# Altium schematic sheet Core.SchDoc: DrumLooper
size A3; Author: Max; CompanyName: maxvandenbussche.be; DrawnBy: Max; Engineer: Max; Organization: project; Address1: Synthasaurus; Address2: Percussion; Address4: Max Vandenbussche; DocumentNumber: 180606
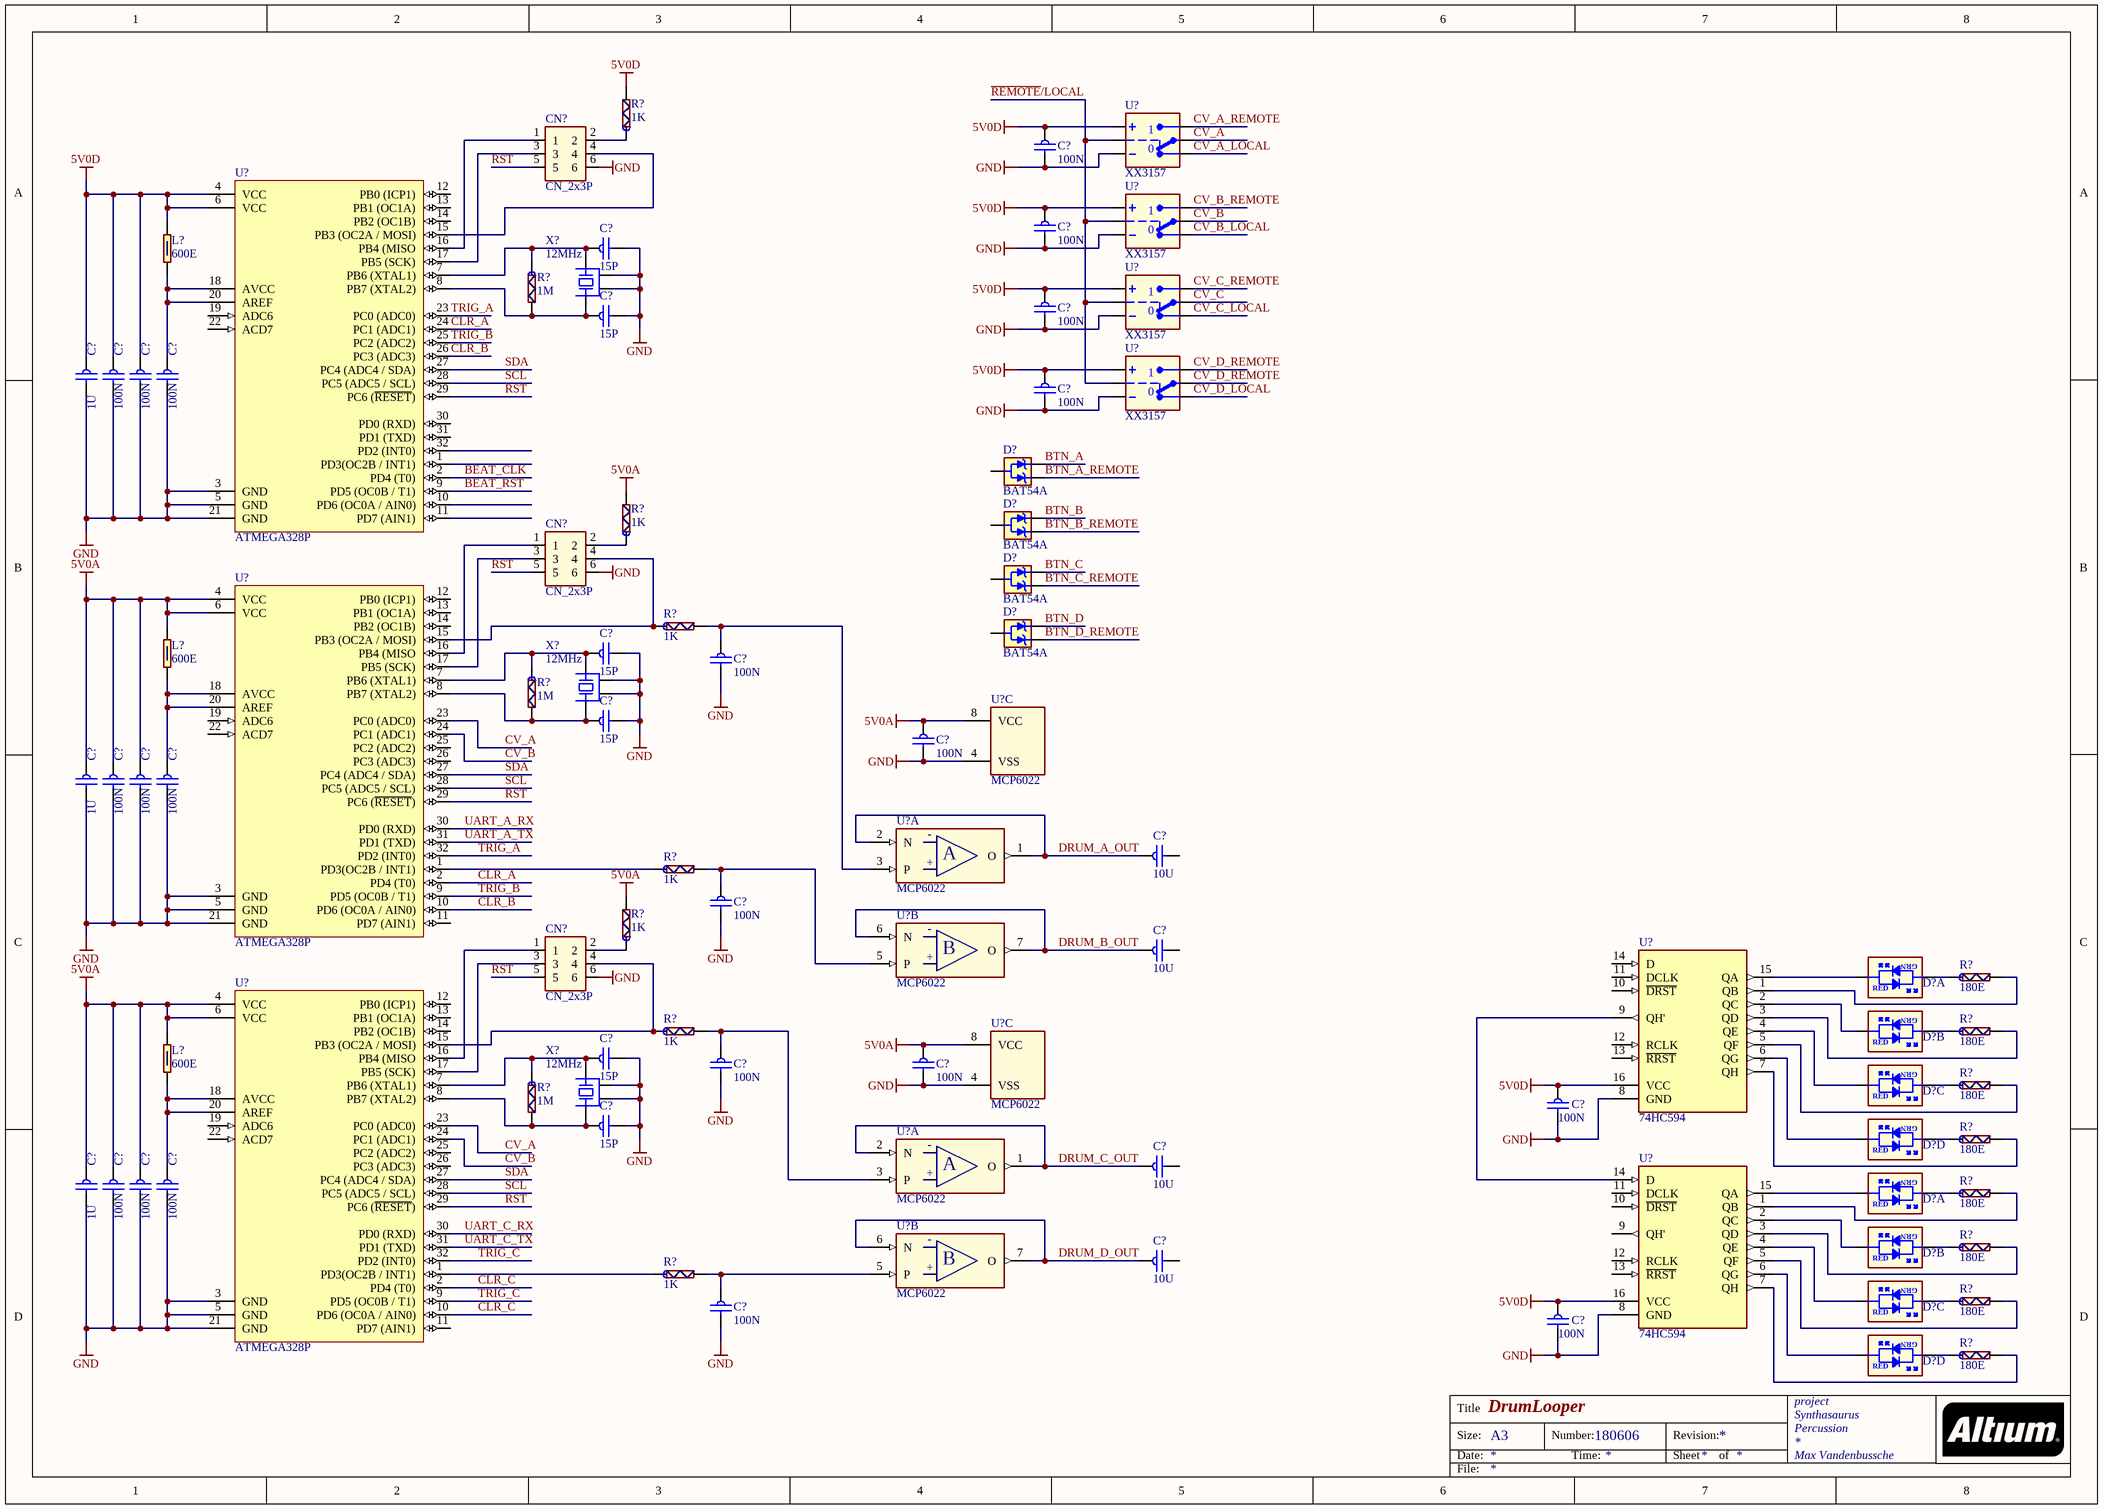
[diagram p0: Core.SchDoc]

## Parts
(Parts that share a designator on the sheet are numbered #1, #2 ... from top to bottom, then left to right.)
C?#1  100N  [CA_STD0603_H8]
C?#2  100N  [CA_STD0603_H8]
C?#3  15P  [CA_STD0603_H8]
C?#4  100N  [CA_STD0603_H8]
C?#5  15P  [CA_STD0603_H8]
C?#6  1U  [CA_STD0603_H8]
C?#7  100N  [CA_STD0603_H8]
C?#8  100N  [CA_STD0603_H8]
C?#9  100N  [CA_STD0603_H8]
C?#10  100N  [CA_STD0603_H8]
C?#11  15P  [CA_STD0603_H8]
C?#12  100N  [CA_STD0603_H8]
C?#13  15P  [CA_STD0603_H8]
C?#14  100N  [CA_STD0603_H8]
C?#15  1U  [CA_STD0603_H8]
C?#16  100N  [CA_STD0603_H8]
C?#17  100N  [CA_STD0603_H8]
C?#18  100N  [CA_STD0603_H8]
C?#19  10U  [CA_STD0603_H8]
C?#20  100N  [CA_STD0603_H8]
C?#21  10U  [CA_STD0603_H8]
C?#22  15P  [CA_STD0603_H8]
C?#23  100N  [CA_STD0603_H8]
C?#24  100N  [CA_STD0603_H8]
C?#25  100N  [CA_STD0603_H8]
C?#26  15P  [CA_STD0603_H8]
C?#27  10U  [CA_STD0603_H8]
C?#28  1U  [CA_STD0603_H8]
C?#29  100N  [CA_STD0603_H8]
C?#30  100N  [CA_STD0603_H8]
C?#31  100N  [CA_STD0603_H8]
C?#32  10U  [CA_STD0603_H8]
C?#33  100N  [CA_STD0603_H8]
C?#34  100N  [CA_STD0603_H8]
CN?#1  CN_2x3P  [CN_HDR2x3_SHROUDED]
CN?#2  CN_2x3P  [CN_HDR2x3_SHROUDED]
CN?#3  CN_2x3P  [CN_HDR2x3_SHROUDED]
D?#1  BAT54A  [SC_SOT23_3P]
D?#2  BAT54A  [SC_SOT23_3P]
D?#3  BAT54A  [SC_SOT23_3P]
D?#4  BAT54A  [SC_SOT23_3P]
D?#5  DI_STD_QUAD_LED_BIRG  [DI_STD_3MM_QUAD4LD_VERTICAL]  (value not drawn)  (part A of 4)
D?#6  DI_STD_QUAD_LED_BIRG  [DI_STD_3MM_QUAD4LD_VERTICAL]  (value not drawn)  (part B of 4)
D?#7  DI_STD_QUAD_LED_BIRG  [DI_STD_3MM_QUAD4LD_VERTICAL]  (value not drawn)  (part C of 4)
D?#8  DI_STD_QUAD_LED_BIRG  [DI_STD_3MM_QUAD4LD_VERTICAL]  (value not drawn)  (part D of 4)
D?#9  DI_STD_QUAD_LED_BIRG  [DI_STD_3MM_QUAD4LD_VERTICAL]  (value not drawn)  (part A of 4)
D?#10  DI_STD_QUAD_LED_BIRG  [DI_STD_3MM_QUAD4LD_VERTICAL]  (value not drawn)  (part B of 4)
D?#11  DI_STD_QUAD_LED_BIRG  [DI_STD_3MM_QUAD4LD_VERTICAL]  (value not drawn)  (part C of 4)
D?#12  DI_STD_QUAD_LED_BIRG  [DI_STD_3MM_QUAD4LD_VERTICAL]  (value not drawn)  (part D of 4)
L?#1  600E  [CA_STD0603_H8]
L?#2  600E  [CA_STD0603_H8]
L?#3  600E  [CA_STD0603_H8]
R?#1  1K  [RE_STD0603_H5]
R?#2  1M  [RE_STD0603_H5]
R?#3  1K  [RE_STD0603_H5]
R?#4  1K  [RE_STD0603_H5]
R?#5  1M  [RE_STD0603_H5]
R?#6  1K  [RE_STD0603_H5]
R?#7  1K  [RE_STD0603_H5]
R?#8  180E  [RE_STD0603_H5]
R?#9  1K  [RE_STD0603_H5]
R?#10  180E  [RE_STD0603_H5]
R?#11  180E  [RE_STD0603_H5]
R?#12  1M  [RE_STD0603_H5]
R?#13  180E  [RE_STD0603_H5]
R?#14  180E  [RE_STD0603_H5]
R?#15  180E  [RE_STD0603_H5]
R?#16  1K  [RE_STD0603_H5]
R?#17  180E  [RE_STD0603_H5]
R?#18  180E  [RE_STD0603_H5]
U?#1  XX3157  [SC_SOT363-6]
U?#2  XX3157  [SC_SOT363-6]
U?#3  XX3157  [SC_SOT363-6]
U?#4  ATMEGA328P  [SC_QFP32_70X70_P8]
U?#5  XX3157  [SC_SOT363-6]
U?#6  MCP6022  [SC_SO8]  (part C of 3)
U?#7  ATMEGA328P  [SC_QFP32_70X70_P8]
U?#8  MCP6022  [SC_SO8]  (part A of 3)
U?#9  MCP6022  [SC_SO8]  (part B of 3)
U?#10  74HC594  [SC_TSSOP16]
U?#11  MCP6022  [SC_SO8]  (part C of 3)
U?#12  ATMEGA328P  [SC_QFP32_70X70_P8]
U?#13  MCP6022  [SC_SO8]  (part A of 3)
U?#14  74HC594  [SC_TSSOP16]
U?#15  MCP6022  [SC_SO8]  (part B of 3)
X?#1  12MHz  [XL_STD_3225_4P]
X?#2  12MHz  [XL_STD_3225_4P]
X?#3  12MHz  [XL_STD_3225_4P]

## Nets
5V0A: C?#14.1 C?#15.1 C?#16.1 C?#17.1 C?#24.1 C?#28.1 C?#29.1 C?#30.1 L?#2.1 L?#3.1 R?#3.2 R?#7.2 U?#6.8(VCC) U?#7.4(VCC) U?#7.6(VCC) U?#11.8(VCC) U?#12.4(VCC) U?#12.6(VCC)
5V0D: C?#1.1 C?#2.1 C?#4.1 C?#6.1 C?#7.1 C?#8.1 C?#10.1 C?#25.1 C?#34.1 L?#1.1 R?#1.2 U?#1.5(VCC) U?#2.5(VCC) U?#3.5(VCC) U?#4.4(VCC) U?#4.6(VCC) U?#5.5(VCC) U?#10.16(VCC) U?#14.16(VCC)
GND: C?#1.2 C?#2.2 C?#3.2 C?#4.2 C?#5.2 C?#6.2 C?#7.2 C?#8.2 C?#9.2 C?#10.2 C?#11.2 C?#12.2 C?#13.2 C?#14.2 C?#15.2 C?#16.2 C?#17.2 C?#18.2 C?#20.2 C?#22.2 C?#23.2 C?#24.2 C?#25.2 C?#26.2 C?#28.2 C?#29.2 C?#30.2 C?#31.2 C?#33.2 C?#34.2 CN?#1.6 CN?#2.6 CN?#3.6 U?#1.2(GND) U?#2.2(GND) U?#3.2(GND) U?#4.3(GND) U?#4.5(GND) U?#4.21(GND) U?#5.2(GND) U?#6.4(VSS) U?#7.3(GND) U?#7.5(GND) U?#7.21(GND) U?#10.8(GND) U?#11.4(VSS) U?#12.3(GND) U?#12.5(GND) U?#12.21(GND) U?#14.8(GND) X?#1.2 X?#1.4 X?#2.2 X?#2.4 X?#3.2 X?#3.4
BEAT_CLK: U?#4.2(PD4_(T0))
BEAT_RST: U?#4.9(PD5_(OC0B_/_T1))
BTN_A: D?#1.2(C2)
BTN_A_REMOTE: D?#1.1(C1)
BTN_B: D?#2.2(C2)
BTN_B_REMOTE: D?#2.1(C1)
BTN_C: D?#3.2(C2)
BTN_C_REMOTE: D?#3.1(C1)
BTN_D: D?#4.2(C2)
BTN_D_REMOTE: D?#4.1(C1)
CLR_A: U?#4.24(PC1_(ADC1)) U?#7.2(PD4_(T0))
CLR_B: U?#4.26(PC3_(ADC3)) U?#7.10(PD6_(OC0A_/_AIN0))
CLR_C: U?#12.2(PD4_(T0)) U?#12.10(PD6_(OC0A_/_AIN0))
CV_A: U?#1.4(COM) U?#7.23(PC0_(ADC0)) U?#12.23(PC0_(ADC0))
CV_A_LOCAL: U?#1.3(NCL)
CV_A_REMOTE: U?#1.1(NO)
CV_B: U?#2.4(COM) U?#7.24(PC1_(ADC1)) U?#12.24(PC1_(ADC1))
CV_B_LOCAL: U?#2.3(NCL)
CV_B_REMOTE: U?#2.1(NO)
CV_C: U?#3.4(COM)
CV_C_LOCAL: U?#3.3(NCL)
CV_C_REMOTE: U?#3.1(NO)
CV_D_LOCAL: U?#5.3(NCL)
CV_D_REMOTE: U?#5.1(NO) U?#5.4(COM)
DRUM_A_OUT: C?#19.1 U?#8.1(O) U?#8.2(N)
DRUM_B_OUT: C?#21.1 U?#9.6(N) U?#9.7(O)
DRUM_C_OUT: C?#27.1 U?#13.1(O) U?#13.2(N)
DRUM_D_OUT: C?#32.1 U?#15.6(N) U?#15.7(O)
~{REMOTE}/LOCAL: U?#1.6(SEL) U?#2.6(SEL) U?#3.6(SEL) U?#5.6(SEL)
RST: CN?#1.5 CN?#2.5 CN?#3.5 U?#4.29(PC6_(~{RESET})) U?#7.29(PC6_(~{RESET})) U?#12.29(PC6_(~{RESET}))
SCL: U?#4.28(PC5_(ADC5_/_SCL)) U?#7.28(PC5_(ADC5_/_SCL)) U?#12.28(PC5_(ADC5_/_SCL))
SDA: U?#4.27(PC4_(ADC4_/_SDA)) U?#7.27(PC4_(ADC4_/_SDA)) U?#12.27(PC4_(ADC4_/_SDA))
TRIG_A: U?#4.23(PC0_(ADC0)) U?#7.32(PD2_(INT0))
TRIG_B: U?#4.25(PC2_(ADC2)) U?#7.9(PD5_(OC0B_/_T1))
TRIG_C: U?#12.9(PD5_(OC0B_/_T1)) U?#12.32(PD2_(INT0))
UART_A_RX: U?#7.30(PD0_(RXD))
UART_A_TX: U?#7.31(PD1_(TXD))
UART_C_RX: U?#12.30(PD0_(RXD))
UART_C_TX: U?#12.31(PD1_(TXD))
NetC?#3_1: C?#3.1 R?#2.1 U?#4.7(PB6_(XTAL1)) X?#1.3
NetC?#5_1: C?#5.1 R?#2.2 U?#4.8(PB7_(XTAL2)) X?#1.1
NetC?#9_1: C?#9.1 L?#1.2 U?#4.18(AVCC) U?#4.20(AREF)
NetC?#11_1: C?#11.1 R?#5.1 U?#7.7(PB6_(XTAL1)) X?#2.3
NetC?#12_1: C?#12.1 R?#4.2 U?#8.3(P)
NetC?#13_1: C?#13.1 R?#5.2 U?#7.8(PB7_(XTAL2)) X?#2.1
NetC?#18_1: C?#18.1 L?#2.2 U?#7.18(AVCC) U?#7.20(AREF)
NetC?#20_1: C?#20.1 R?#6.2 U?#9.5(P)
NetC?#22_1: C?#22.1 R?#12.1 U?#12.7(PB6_(XTAL1)) X?#3.3
NetC?#23_1: C?#23.1 R?#9.2 U?#13.3(P)
NetC?#26_1: C?#26.1 R?#12.2 U?#12.8(PB7_(XTAL2)) X?#3.1
NetC?#31_1: C?#31.1 L?#3.2 U?#12.18(AVCC) U?#12.20(AREF)
NetC?#33_1: C?#33.1 R?#16.2 U?#15.5(P)
NetCN?#1_1: CN?#1.1 U?#4.16(PB4_(MISO)
NetCN?#1_2: CN?#1.2 R?#1.1
NetCN?#1_3: CN?#1.3 U?#4.17(PB5_(SCK))
NetCN?#1_4: CN?#1.4 U?#4.15(PB3_(OC2A_/_MOSI))
NetCN?#2_1: CN?#2.1 U?#7.16(PB4_(MISO)
NetCN?#2_2: CN?#2.2 R?#3.1
NetCN?#2_3: CN?#2.3 U?#7.17(PB5_(SCK))
NetCN?#2_4: CN?#2.4 R?#4.1 U?#7.15(PB3_(OC2A_/_MOSI))
NetCN?#3_1: CN?#3.1 U?#12.16(PB4_(MISO)
NetCN?#3_2: CN?#3.2 R?#7.1
NetCN?#3_3: CN?#3.3 U?#12.17(PB5_(SCK))
NetCN?#3_4: CN?#3.4 R?#9.1 U?#12.15(PB3_(OC2A_/_MOSI))
NetD?#5_A1: D?#5.A1 U?#10.15(QA)
NetD?#5_C1: D?#5.C1 R?#8.1
NetD?#6_A2: D?#6.A2 U?#10.2(QC)
NetD?#6_C2: D?#6.C2 R?#10.1
NetD?#7_A3: D?#7.A3 U?#10.4(QE)
NetD?#7_C3: D?#7.C3 R?#11.1
NetD?#8_A4: D?#8.A4 U?#10.6(QG)
NetD?#8_C4: D?#8.C4 R?#13.1
NetD?#9_A1: D?#9.A1 U?#14.15(QA)
NetD?#9_C1: D?#9.C1 R?#14.1
NetD?#10_A2: D?#10.A2 U?#14.2(QC)
NetD?#10_C2: D?#10.C2 R?#15.1
NetD?#11_A3: D?#11.A3 U?#14.4(QE)
NetD?#11_C3: D?#11.C3 R?#17.1
NetD?#12_A4: D?#12.A4 U?#14.6(QG)
NetD?#12_C4: D?#12.C4 R?#18.1
NetR?#6_1: R?#6.1 U?#7.1(PD3(OC2B_/_INT1))
NetR?#8_2: R?#8.2 U?#10.1(QB)
NetR?#10_2: R?#10.2 U?#10.3(QD)
NetR?#11_2: R?#11.2 U?#10.5(QF)
NetR?#13_2: R?#13.2 U?#10.7(QH)
NetR?#14_2: R?#14.2 U?#14.1(QB)
NetR?#15_2: R?#15.2 U?#14.3(QD)
NetR?#16_1: R?#16.1 U?#12.1(PD3(OC2B_/_INT1))
NetR?#17_2: R?#17.2 U?#14.5(QF)
NetR?#18_2: R?#18.2 U?#14.7(QH)
NetU?#10_9: U?#10.9(QH') U?#14.14(D)

Not connected (* = marked no-connect by the designer): C?#19 2; C?#21 2; C?#27 2; C?#32 2; D?#1 3(A); D?#2 3(A); D?#3 3(A); D?#4 3(A); U?#4 1(PD3(OC2B_/_INT1)) 10(PD6_(OC0A_/_AIN0)) 11(PD7_(AIN1)) 12(PB0_(ICP1)) 13(PB1_(OC1A)) 14(PB2_(OC1B)) 19(ADC6) 22(ACD7) 30(PD0_(RXD)) 31(PD1_(TXD)) 32(PD2_(INT0)); U?#7 11(PD7_(AIN1)) 12(PB0_(ICP1)) 13(PB1_(OC1A)) 14(PB2_(OC1B)) 19(ADC6) 22(ACD7) 25(PC2_(ADC2)) 26(PC3_(ADC3)); U?#10 10(~{DRST}) 11(DCLK) 12(RCLK) 13(~{RRST}) 14(D); U?#12 11(PD7_(AIN1)) 12(PB0_(ICP1)) 13(PB1_(OC1A)) 14(PB2_(OC1B)) 19(ADC6) 22(ACD7) 25(PC2_(ADC2)) 26(PC3_(ADC3)); U?#14 9(QH') 10(~{DRST}) 11(DCLK) 12(RCLK) 13(~{RRST})

## Notes on the sheet
- Title
- Size:
- Date:
- A3
- Number:
- Time:
- Revision:
- Sheet
- of
- File:
- (in symbol DIL3RG-5, part A) GRN; RED
- (in symbol DIL3RG-5, part B) GRN; RED
- (in symbol DIL3RG-5, part C) GRN; RED
- (in symbol DIL3RG-5, part D) GRN; RED
- (in symbol YICSAMCP6022, part A) -; A; +
- (in symbol YICSAMCP6022, part B) -; B; +
- (in symbol YICT74LVC1G3157) 0

## Library data of the parts
C?#1 C?#2 C?#4 C?#7-C?#10 C?#12 C?#14 C?#16-C?#18 C?#20 C?#23-C?#25 C?#29-C?#31 C?#33 C?#34 = YCAM100N-5: STD MLCC 100nF 50V X7R 10% 0603; Property 1: 0603; 3D_model: step; Order Code: murata/GCJ188R71H104KA12D; Article: YCAM100N-5; Catalogus_Nr: YCAM100N-5; Category: Capacitor; SubCategory: Ceramic; Status: P; Value: 100N; Property 2: 50V; Property 3: X7R; Cost: 0,003
C?#3 C?#5 C?#11 C?#13 C?#22 C?#26 = YCAM15P-1: STD MLCC 15pF 2% C0G/NP0 50V -55°C to +125°C 30ppm 0603; Property 1: 0603; Property 3: C0G; 3D_model: step; Article: YCAM15P-1; Catalogus_Nr: YCAM15P-1; Category: Capacitor; SubCategory: Ceramic; Status: P; Value: 15P; Property 2: 50V; Cost: 0,020
C?#6 C?#15 C?#28 = YCAM1U-3: STD MLCC 1uF 10% X5R 16V -55°C to +85°C 15% 0603; Property 1: 0603; 3D_model: step; Order Code: 0603YD105KAT2A; Article: YCAM1U-3; Catalogus_Nr: YCAM1U-3; Category: Capacitor; SubCategory: Ceramic; Status: P; Value: 1U; Property 2: 16V; Property 3: X5R; Cost: 0,005
C?#19 C?#21 C?#27 C?#32 = YCAM10U-2: STD MLCC 10uF 10% X5R 6V3 -55°C to +85°C 15% 0603; Property 1: 0603; 3D_model: step; Order Code: kemet/C0603C106M9PACTU; Article: YCAM10U-2; Catalogus_Nr: YCAM10U-2; Category: Capacitor; SubCategory: Ceramic; Status: P; Value: 10U; Property 2: 6V3; Property 3: X5R; Cost: 0,015
CN?#1-CN?#3 = 09 18 506 7324: HEADER, VERT, N/LATCH, 2x3WAY; Order Code: FN 1097005; Article: 09 18 506 7324; Category: Connector; SubCategory: IDC; Status: A; Value: 09 18 506 7324
D?#1-D?#4 = YDIOBAT54-3: Schottky 30V/0.2A; Property 1: 30V; Property 2: 200MA; 3D_model: step; Article: YDIOBAT54-3; Catalogus_Nr: YDIOBAT54-3; Category: Diode; SubCategory: Schottky; Status: A; Value: BAT54A; Cost: 0,010
D?#5-D?#12 = DIL3RG-5: LED BAR 3mm 4x Red/Green TH QUAD 90D; Value: 4RG; Property 2: TH 3mm; 3D_model: step; Order Code: 5680701111F; Article: DIL3RG-5; Catalogus_Nr: DIL3RG-5; Category: Diode; SubCategory: LED; Status: P; Property 1: QUAD; Cost: 0,900
L?#1-L?#3 = YCOLFB600E-2: FERRITE BEAD 0.4OHM 300mA; Property 1: 250MA; Property 2: 0603; Property 3: 400mOhm; 3D_model: step; Order Code: BK1608HW601-T; Article: YCOLFB600E-2; Catalogus_Nr: YCOLFB600E-2; Category: Inductor; SubCategory: Bead; Status: P; Value: 600E; Cost: 0,020
R?#1 R?#3 R?#4 R?#6 R?#7 R?#9 R?#16 = YRES1K-1: Chip-1K/100mW/1%/100ppm/100V/-40°C/+125°C; Property 1: 0603; Property 2: 1%; Property 3: 100mW; 3D_model: step; Order Code: RC0603FR-071KL; Article: YRES1K-1; Catalogus_Nr: YRES1K-1; Category: Resistor; SubCategory: STD0603; Status: P; Value: 1K; Cost: 0,0005
R?#2 R?#5 R?#12 = YRES1M-1: Chip-1M/100mW/1%/100ppm/100V/-40°C/+125°C; Property 1: 0603; Property 2: 1%; Property 3: 100mW; 3D_model: step; Article: YRES1M-1; Catalogus_Nr: YRES1M-1; Category: Resistor; SubCategory: STD0603; Status: P; Value: 1M; Cost: 0,0005
R?#8 R?#10 R?#11 R?#13-R?#15 R?#17 R?#18 = YRES180E-1: Chip-180E/100mW/1%/100ppm/100V/-40°C/+125°C; Property 1: 0603; Property 2: 1%; Property 3: 100mW; 3D_model: step; Article: YRES180E-1; Catalogus_Nr: YRES180E-1; Category: Resistor; SubCategory: STD0603; Status: P; Value: 180E; Cost: 0,0005
U?#1-U?#3 U?#5 = YICT74LVC1G3157: DPDT analog switch; Order Code: NLASB3157DFT2G; Article: YICT74LVC1G3157; Catalogus_Nr: YICT74LVC1G3157; Category: IC; SubCategory: Switch; Status: P; Value: XX3157; Cost: 0,050
U?#4 U?#7 U?#12 = ATMEGA328P: Value: IC_ATMEGA328P; Order Code: FN 2443178; Article: ATMEGA328P; Category: IC; SubCategory: Microcontroller; Status: A
U?#6 U?#8 U?#9 U?#11 U?#13 U?#15 = YICSAMCP6022: Opamp GP - RailToRail IO; 3D_model: step; Order Code: FN 1642732 / RS 795-9237; Article: YICSAMCP6022; Catalogus_Nr: YICSAMCP6022; Category: IC; SubCategory: OPAMP; Status: P; Value: MCP6022; Cost: 0,300
U?#10 U?#14 = YICT74AHC594: STD SREG SIPO 8bit 2V-6V -40°C to +85°C  TSSOP16; Property 1: Shift Register; 3D_model: step; Order Code: DK 296-35926-1-ND; Article: YICT74AHC594; Catalogus_Nr: YICT74AHC594; Category: IC; SubCategory: Logic; Status: P; Value: 74HC594; Cost: 0,120
X?#1-X?#3 = YXTL12M00-4: STD XT Fundamental 12MHz 18pF 20ppm 100ohm 200µW; Property 1: SMD3225; 3D_model: step; Order Code: DK 1253-1427-1-ND; Article: YXTL12M00-4; Catalogus_Nr: YXTL12M00-4; Category: Crystal; SubCategory: Fundamental; Status: P; Value: 12MHz; Property 2: 18pF; Property 3: 20ppm; Cost: 0,200